# EasyEDA Pro project esp32-pcb.eprj

# Schematic Schematic1
Create Date: 2023-06-14; Page Name: P1; Project Name: esp32-pcb; Schematic Name: Schematic1; Update Date: 2023-06-14; Company: EasyEDA.com; Drawed: EasyEDA Pro; Page Size: A4; Part Number: JLCPCB-002; Reviewed: EasyEDA Pro; Version: V0.1
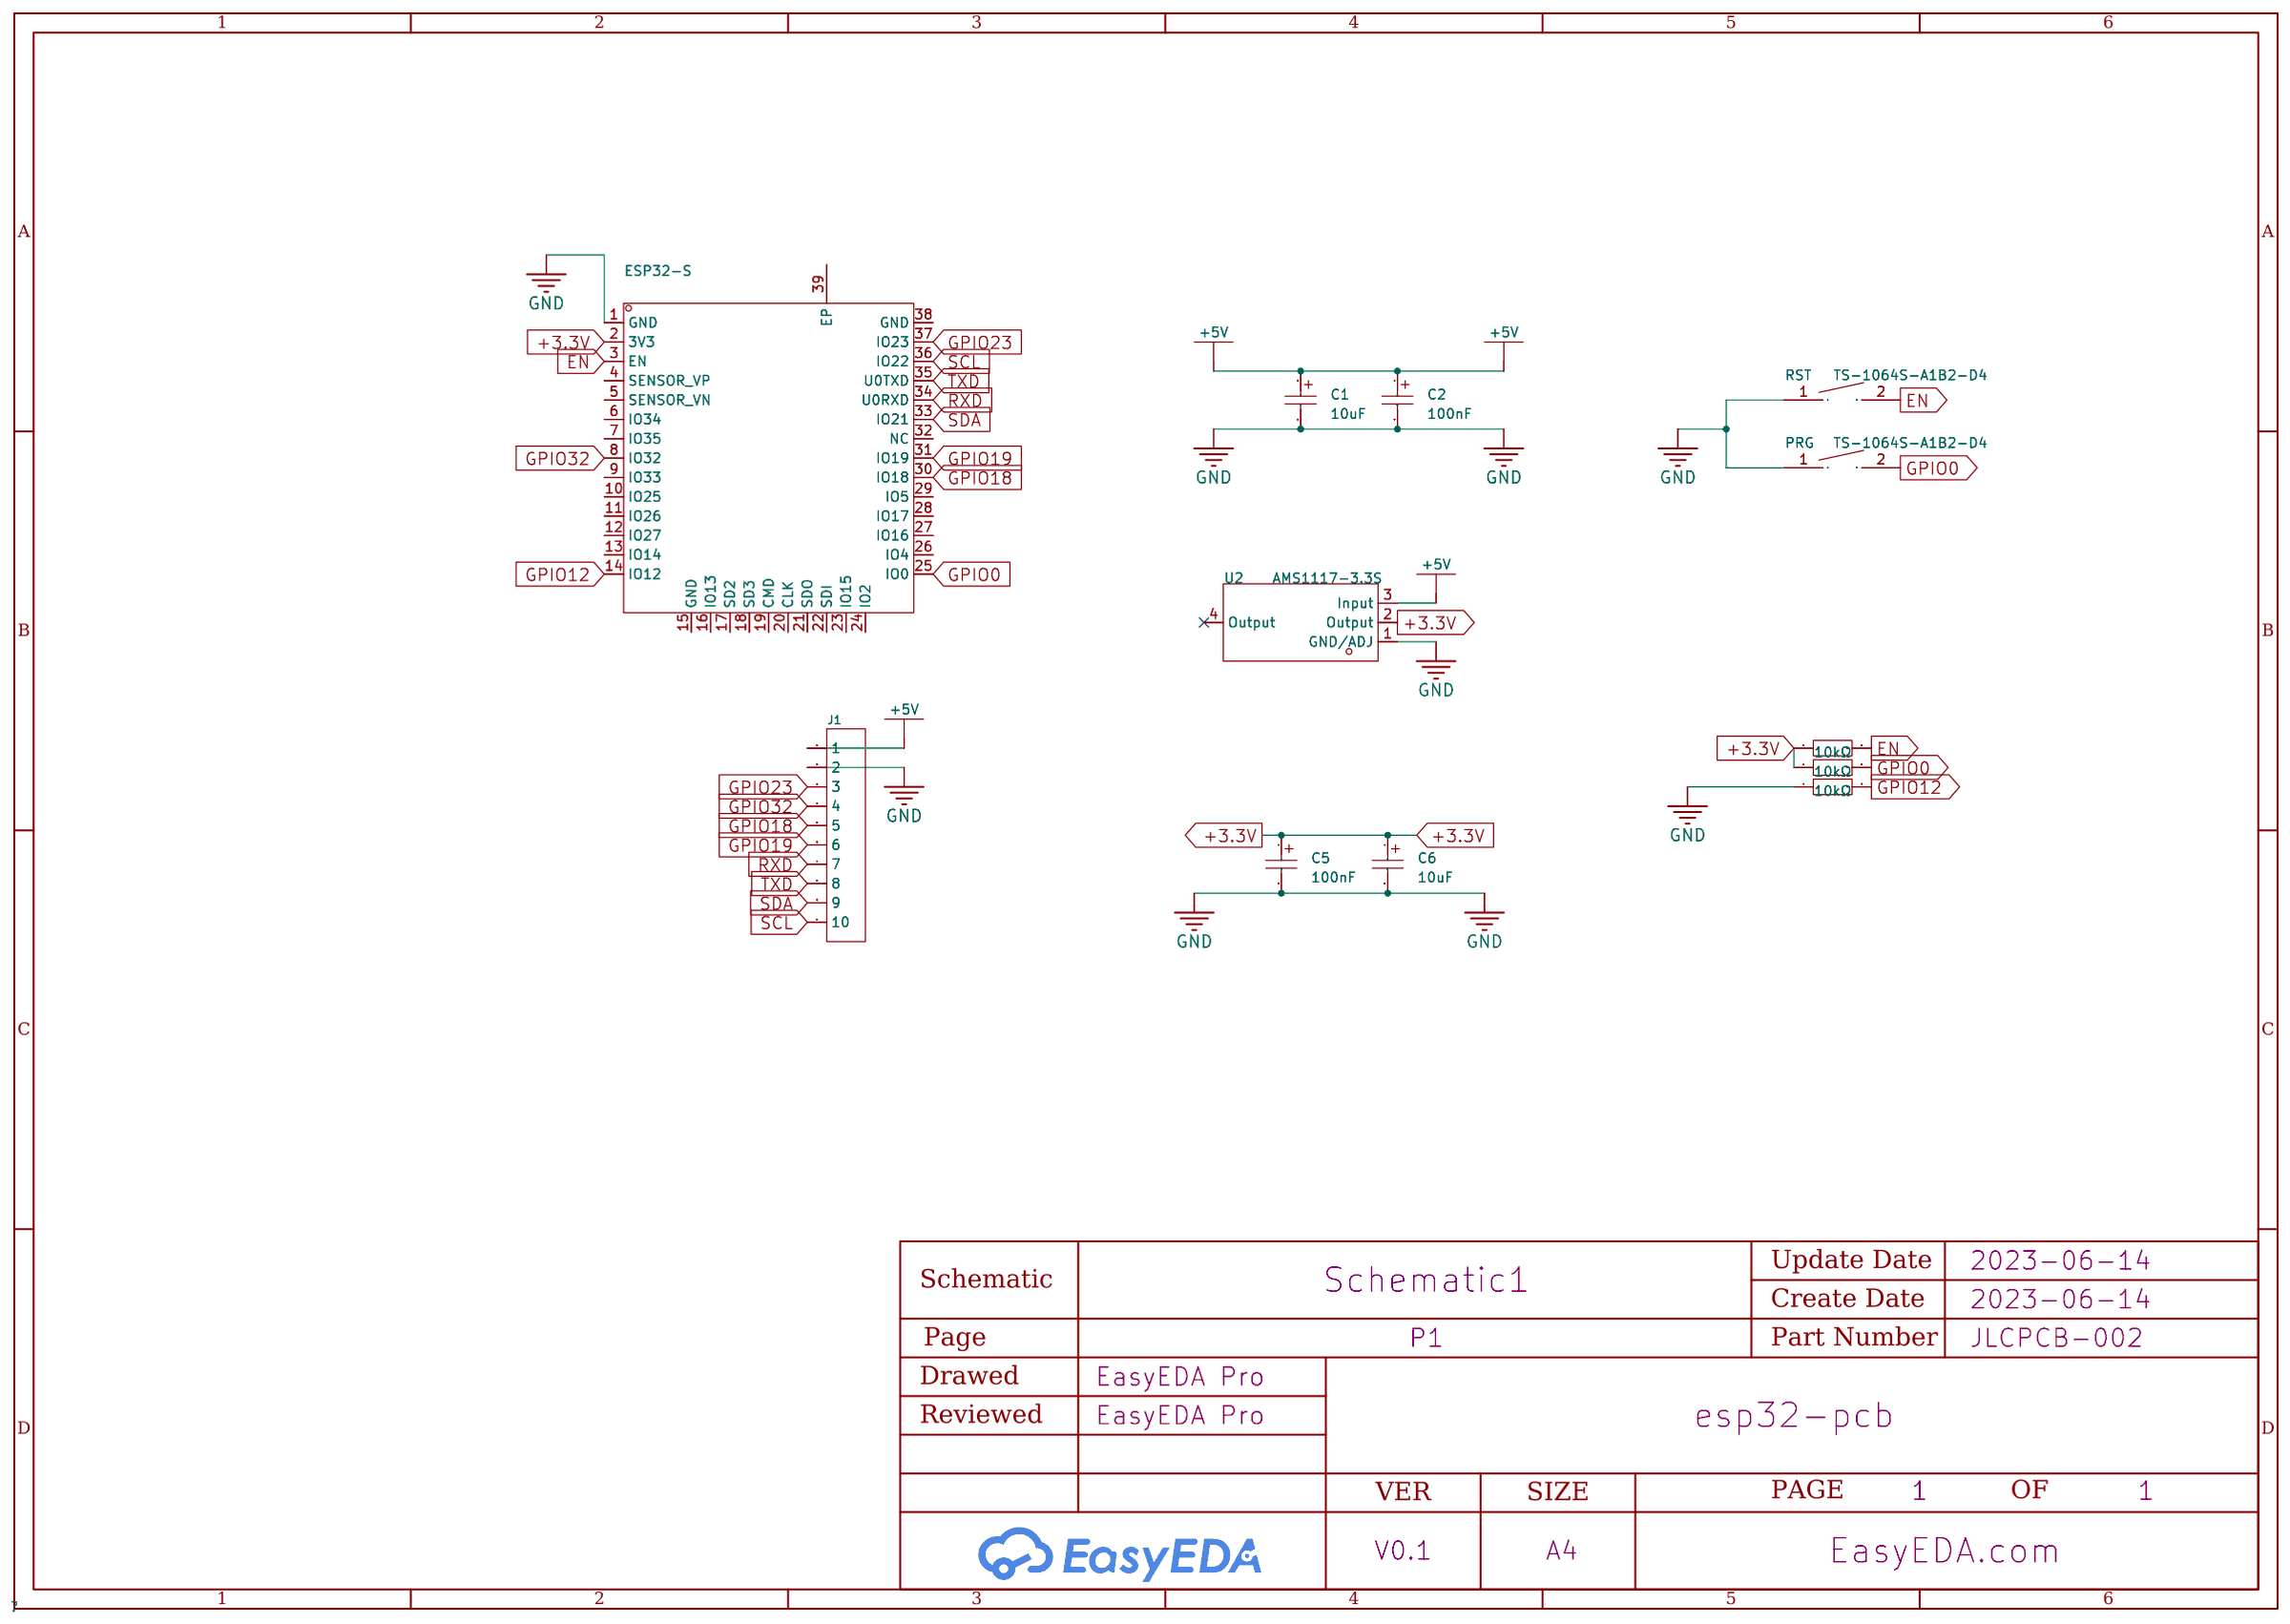
[diagram p0: schematic sheet]

## Parts
C1  10uF  [CASE-A_3216]
C2  100nF  [CASE-A_3216]
C5  100nF  [CASE-A_3216]
C6  10uF  [CASE-A_3216]
ESP32-S  2.4GHz  [WIRELM-SMD_ESP32-S]
J1  HDR-M-2.54_1x10  [HDR-TH_10P-P2.54-V-F-R2-C5-S2.54-4]
PRG  TS-1064S-A1B2-D4  [KEY-SMD_L3.0-W2.5-LS4.0]
R2  10kΩ  [R0603]
R3  10kΩ  [R0603]
R4  10kΩ  [R0603]
RST  TS-1064S-A1B2-D4  [KEY-SMD_L3.0-W2.5-LS4.0]
U2  AMS1117-3.3S  [SOT-223-4_L6.5-W3.5-P2.30-LS7.0-BL]

## Library data of the parts
C1 C6 = TAJA106K010RNJ: Capacitance: Tolerance:±10% Tolerance:±10% Rated Voltage: Equivalent Series Resistance(ESR):3Ω@100kHz Operating Temperature:-55~+125 Operating Temperature:-55~+125; LCSC Part Name: 10uF ±10% 10V; Supplier Part: C7177; Manufacturer: Kyocera AVX; JLCPCB Part Class: Extended Part; Datasheet: https://atta.szlcsc.com/upload/public/pdf/source/20160107/1457707748330.pdf; Supplier: LCSC; Tolerance: ±10%; Equivalent Series Resistance(ESR): 3Ω@100kHz; Operating Temperature: -55~+125
C2 C5 = TAJA104K035RNJ: Capacitance: Tolerance:±10% Tolerance:±10% Rated Voltage: Equivalent Series Resistance(ESR):24Ω@100kHz Operating Temperature:-55~+125 Operating Temperature:-55~+125; LCSC Part Name: 100nF ±10% 35V; Supplier Part: C7173; Manufacturer: Kyocera AVX; JLCPCB Part Class: Extended Part; Datasheet: https://atta.szlcsc.com/upload/public/pdf/source/20160107/1457707748183.pdf; Supplier: LCSC; Tolerance: ±10%; Equivalent Series Resistance(ESR): 24Ω@100kHz; Operating Temperature: -55~+125
ESP32-S = ESP32-S: Frequency:2.4GHz Output Power:17dBm Output Power:17dBm Core Processor:LX6 Support Interface:I2C；UART；DAC；SPI；PWM；ADC Antenna Type:板载 PCB Antenna/外接 IPEX Wireless Standard:802.11b/g/n Operating Voltage:3.3V Operating Voltage:3.3V Receive  Current:- Send  C; Supplier Part: C277944; Manufacturer: Ai-Thinker(安信可); Supplier Footprint: SMD; JLCPCB Part Class: Extended Part; Datasheet: https://atta.szlcsc.com/upload/public/pdf/source/20211217/F4BEA33E732D6002D10DAED85BBCB52B.pdf; Supplier: LCSC; Output Power: 17dBm; Core Processor: LX6; Support Interface: I2C；UART；DAC；SPI；PWM；ADC; Antenna Type: 板载 PCB Antenna/外接 IPEX; Wireless Standard: 802.11b/g/n; Operating Voltage: 3.3V; Sensitivity: -90dBm; Operating Temperature: -40℃~+85℃
J1 = HDR-M-2.54_1x10: Supplier Part: C57369; Supplier: LCSC
PRG RST = TS-1064S-A1B2-D4: Circuit:SPST Mounting Style:Brick nogging Actuator Style:Round Button With Lamp:- Operating Force:180gf@±30gf Switch Length:3mm Switch Width:2.5mm Switch Height:1.5mm; LCSC Part Name: 轻触开关3.0*2.5*1.5正按贴片小小龟180gf; Supplier Part: C498294; Manufacturer: Yuandi(台湾元迪); Supplier Footprint: SMD,3x2.5x1.5mm; JLCPCB Part Class: Extended Part; Datasheet: https://atta.szlcsc.com/upload/public/pdf/source/20200318/C498294_666F8F3E87612379939888B0D532704B.pdf; Supplier: LCSC; Circuit: SPST; Mounting Style: Brick nogging; Actuator Style: Round Button; Operating Force: 180gf@±30gf; Switch Length: 3mm; Switch Width: 2.5mm; Switch Height: 1.5mm
R2-R4 = RC0603JR-0710KL: Overload Voltage (Max): Resistance: Body Length:- Tolerance: φD:- Body Height:- Body Width:- Type:Thick Film Resistors Temperature Coefficient: Temperature Coefficient: Operating Temperature Range: Operating Temperature Range: Power(Watts):; LCSC Part Name: 10kΩ ±5%; Supplier Part: C99198; Manufacturer: YAGEO(国巨); Supplier Footprint: 0603; JLCPCB Part Class: Extended Part; Datasheet: https://atta.szlcsc.com/upload/public/pdf/source/20181223/C99198_917934A193F41F77D9F7D214A8C79116.pdf; Supplier: LCSC; Type: Thick Film Resistors
U2 = AMS1117-3.3S: Supplier Part: C2842296; Manufacturer: KEXIN(科信); Supplier Footprint: SOT-223; JLCPCB Part Class: Extended Part; Datasheet: https://atta.szlcsc.com/upload/public/pdf/source/20220119/687E7B65F4F54F278E2F75AE3BEEDBF9.pdf; Supplier: LCSC

## Nets
+3.3V: C5.1 C6.1 ESP32-S.2(3V3) R2.1 R4.1 U2.2(Output)
+5V: C1.1 C2.1 J1.1 U2.3(Input)
GND: C1.2 C2.2 C5.2 C6.2 ESP32-S.1(GND) J1.2 PRG.1 R3.1 RST.1 U2.1(GND/ADJ)
EN: ESP32-S.3(EN) R2.2 RST.2
GPIO0: ESP32-S.25(IO0) PRG.2 R4.2
GPIO12: ESP32-S.14(IO12) R3.2
GPIO18: ESP32-S.30(IO18) J1.5
GPIO19: ESP32-S.31(IO19) J1.6
GPIO23: ESP32-S.37(IO23) J1.3
GPIO32: ESP32-S.8(IO32) J1.4
RXD: ESP32-S.34(U0RXD) J1.7
SCL: ESP32-S.36(IO22) J1.10
SDA: ESP32-S.33(IO21) J1.9
TXD: ESP32-S.35(U0TXD) J1.8

Not connected (* = marked no-connect by the designer): ESP32-S 4(SENSOR_VP) 5(SENSOR_VN) 6(IO34) 7(IO35) 9(IO33) 10(IO25) 11(IO26) 12(IO27) 13(IO14) 15(GND) 16(IO13) 17(SD2) 18(SD3) 19(CMD) 20(CLK) 21(SDO) 22(SDI) 23(IO15) 24(IO2) 26(IO4) 27(IO16) 28(IO17) 29(IO5) 32(NC) 38(GND) 39(EP); U2 4(Output)*

# Schematic Schematic2
Create Date: 2023-08-26; Page Name: P2; Project Name: esp32-pcb; Schematic Name: Schematic2; Update Date: 2023-08-29; Company: EasyEDA.com; Drawed: EasyEDA Pro; Page Size: A4; Part Number: JLCPCB-002; Reviewed: EasyEDA Pro; Version: V0.1
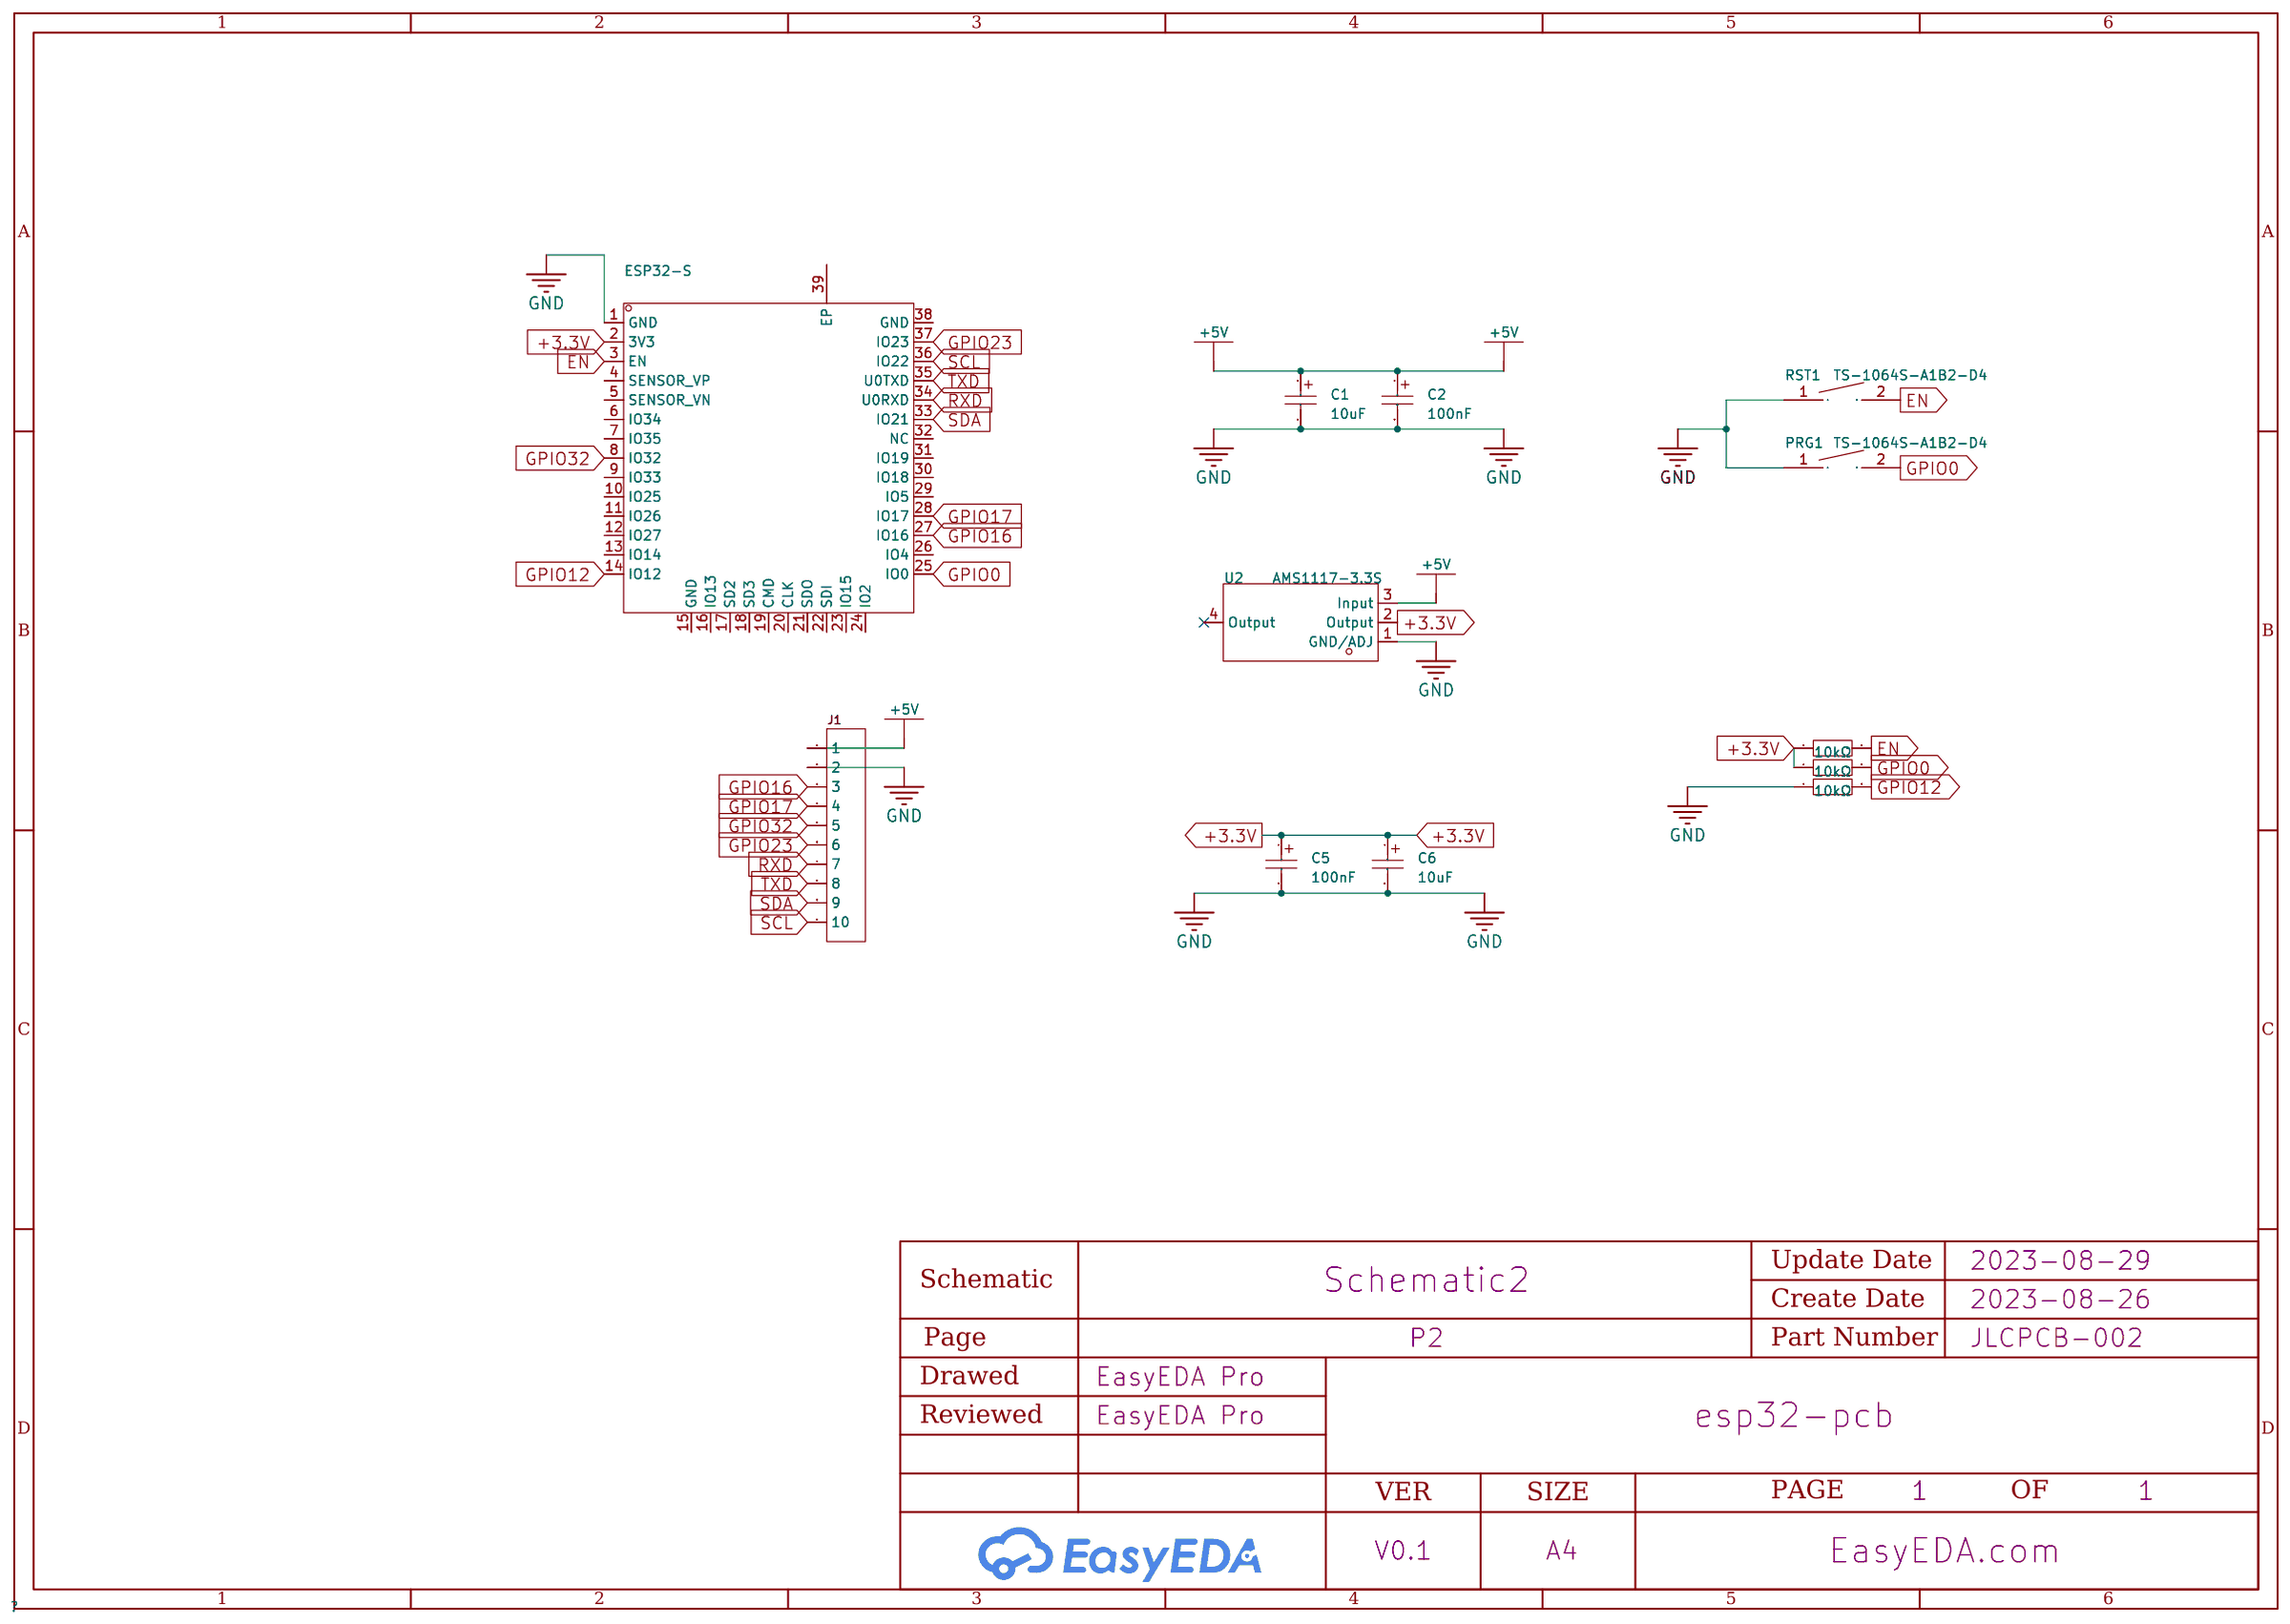
[diagram p1: schematic sheet]

## Parts
C1  10uF  [CASE-A_3216]
C2  100nF  [CASE-A_3216]
C5  100nF  [CASE-A_3216]
C6  10uF  [CASE-A_3216]
ESP32-S  2.4GHz  [WIRELM-SMD_ESP32-S]
J1  HDR-M-2.54_1x10  [HDR-TH_10P-P2.54-V-F-R2-C5-S2.54-4]
PRG1  TS-1064S-A1B2-D4  [KEY-SMD_L3.0-W2.5-LS4.0]
R2  10kΩ  [R0603]
R3  10kΩ  [R0603]
R4  10kΩ  [R0603]
RST1  TS-1064S-A1B2-D4  [KEY-SMD_L3.0-W2.5-LS4.0]
U2  AMS1117-3.3S  [SOT-223-4_L6.5-W3.5-P2.30-LS7.0-BL]

## Library data of the parts
C1 C6 = TAJA106K010RNJ: Capacitance: Tolerance:±10% Tolerance:±10% Rated Voltage: Equivalent Series Resistance(ESR):3Ω@100kHz Operating Temperature:-55~+125 Operating Temperature:-55~+125; LCSC Part Name: 10uF ±10% 10V; Supplier Part: C7177; Manufacturer: Kyocera AVX; JLCPCB Part Class: Extended Part; Datasheet: https://atta.szlcsc.com/upload/public/pdf/source/20160107/1457707748330.pdf; Supplier: LCSC; Tolerance: ±10%; Equivalent Series Resistance(ESR): 3Ω@100kHz; Operating Temperature: -55~+125
C2 C5 = TAJA104K035RNJ: Capacitance: Tolerance:±10% Tolerance:±10% Rated Voltage: Equivalent Series Resistance(ESR):24Ω@100kHz Operating Temperature:-55~+125 Operating Temperature:-55~+125; LCSC Part Name: 100nF ±10% 35V; Supplier Part: C7173; Manufacturer: Kyocera AVX; JLCPCB Part Class: Extended Part; Datasheet: https://atta.szlcsc.com/upload/public/pdf/source/20160107/1457707748183.pdf; Supplier: LCSC; Tolerance: ±10%; Equivalent Series Resistance(ESR): 24Ω@100kHz; Operating Temperature: -55~+125
ESP32-S = ESP32-S: Frequency:2.4GHz Output Power:17dBm Output Power:17dBm Core Processor:LX6 Support Interface:I2C；UART；DAC；SPI；PWM；ADC Antenna Type:板载 PCB Antenna/外接 IPEX Wireless Standard:802.11b/g/n Operating Voltage:3.3V Operating Voltage:3.3V Receive  Current:- Send  C; Supplier Part: C277944; Manufacturer: Ai-Thinker(安信可); Supplier Footprint: SMD; JLCPCB Part Class: Extended Part; Datasheet: https://atta.szlcsc.com/upload/public/pdf/source/20211217/F4BEA33E732D6002D10DAED85BBCB52B.pdf; Supplier: LCSC; Output Power: 17dBm; Core Processor: LX6; Support Interface: I2C；UART；DAC；SPI；PWM；ADC; Antenna Type: 板载 PCB Antenna/外接 IPEX; Wireless Standard: 802.11b/g/n; Operating Voltage: 3.3V; Sensitivity: -90dBm; Operating Temperature: -40℃~+85℃
J1 = HDR-M-2.54_1x10: Supplier Part: C57369; Supplier: LCSC
PRG1 RST1 = TS-1064S-A1B2-D4: Circuit:SPST Mounting Style:Brick nogging Actuator Style:Round Button With Lamp:- Operating Force:180gf@±30gf Switch Length:3mm Switch Width:2.5mm Switch Height:1.5mm; LCSC Part Name: 轻触开关3.0*2.5*1.5正按贴片小小龟180gf; Supplier Part: C498294; Manufacturer: Yuandi(台湾元迪); Supplier Footprint: SMD,3x2.5x1.5mm; JLCPCB Part Class: Extended Part; Datasheet: https://atta.szlcsc.com/upload/public/pdf/source/20200318/C498294_666F8F3E87612379939888B0D532704B.pdf; Supplier: LCSC; Circuit: SPST; Mounting Style: Brick nogging; Actuator Style: Round Button; Operating Force: 180gf@±30gf; Switch Length: 3mm; Switch Width: 2.5mm; Switch Height: 1.5mm
R2-R4 = RC0603JR-0710KL: Overload Voltage (Max): Resistance: Body Length:- Tolerance: φD:- Body Height:- Body Width:- Type:Thick Film Resistors Temperature Coefficient: Temperature Coefficient: Operating Temperature Range: Operating Temperature Range: Power(Watts):; LCSC Part Name: 10kΩ ±5%; Supplier Part: C99198; Manufacturer: YAGEO(国巨); Supplier Footprint: 0603; JLCPCB Part Class: Extended Part; Datasheet: https://atta.szlcsc.com/upload/public/pdf/source/20181223/C99198_917934A193F41F77D9F7D214A8C79116.pdf; Supplier: LCSC; Type: Thick Film Resistors
U2 = AMS1117-3.3S: Supplier Part: C2842296; Manufacturer: KEXIN(科信); Supplier Footprint: SOT-223; JLCPCB Part Class: Extended Part; Datasheet: https://atta.szlcsc.com/upload/public/pdf/source/20220119/687E7B65F4F54F278E2F75AE3BEEDBF9.pdf; Supplier: LCSC

## Nets
+3.3V: C5.1 C6.1 ESP32-S.2(3V3) R2.1 R4.1 U2.2(Output)
+5V: C1.1 C2.1 J1.1 U2.3(Input)
GND: C1.2 C2.2 C5.2 C6.2 ESP32-S.1(GND) J1.2 PRG1.1 R3.1 RST1.1 U2.1(GND/ADJ)
EN: ESP32-S.3(EN) R2.2 RST1.2
GPIO0: ESP32-S.25(IO0) PRG1.2 R4.2
GPIO12: ESP32-S.14(IO12) R3.2
GPIO16: ESP32-S.27(IO16) J1.3
GPIO17: ESP32-S.28(IO17) J1.4
GPIO23: ESP32-S.37(IO23) J1.6
GPIO32: ESP32-S.8(IO32) J1.5
RXD: ESP32-S.34(U0RXD) J1.7
SCL: ESP32-S.36(IO22) J1.10
SDA: ESP32-S.33(IO21) J1.9
TXD: ESP32-S.35(U0TXD) J1.8

Not connected (* = marked no-connect by the designer): ESP32-S 4(SENSOR_VP) 5(SENSOR_VN) 6(IO34) 7(IO35) 9(IO33) 10(IO25) 11(IO26) 12(IO27) 13(IO14) 15(GND) 16(IO13) 17(SD2) 18(SD3) 19(CMD) 20(CLK) 21(SDO) 22(SDI) 23(IO15) 24(IO2) 26(IO4) 29(IO5) 30(IO18) 31(IO19) 32(NC) 38(GND) 39(EP); U2 4(Output)*

# Schematic Schematic3
Create Date: 2023-09-21; Page Name: P2; Project Name: esp32-pcb; Schematic Name: Schematic3; Update Date: 2023-10-17; Company: EasyEDA.com; Drawed: EasyEDA Pro; Page Size: A4; Part Number: JLCPCB-002; Reviewed: EasyEDA Pro; Version: V0.1
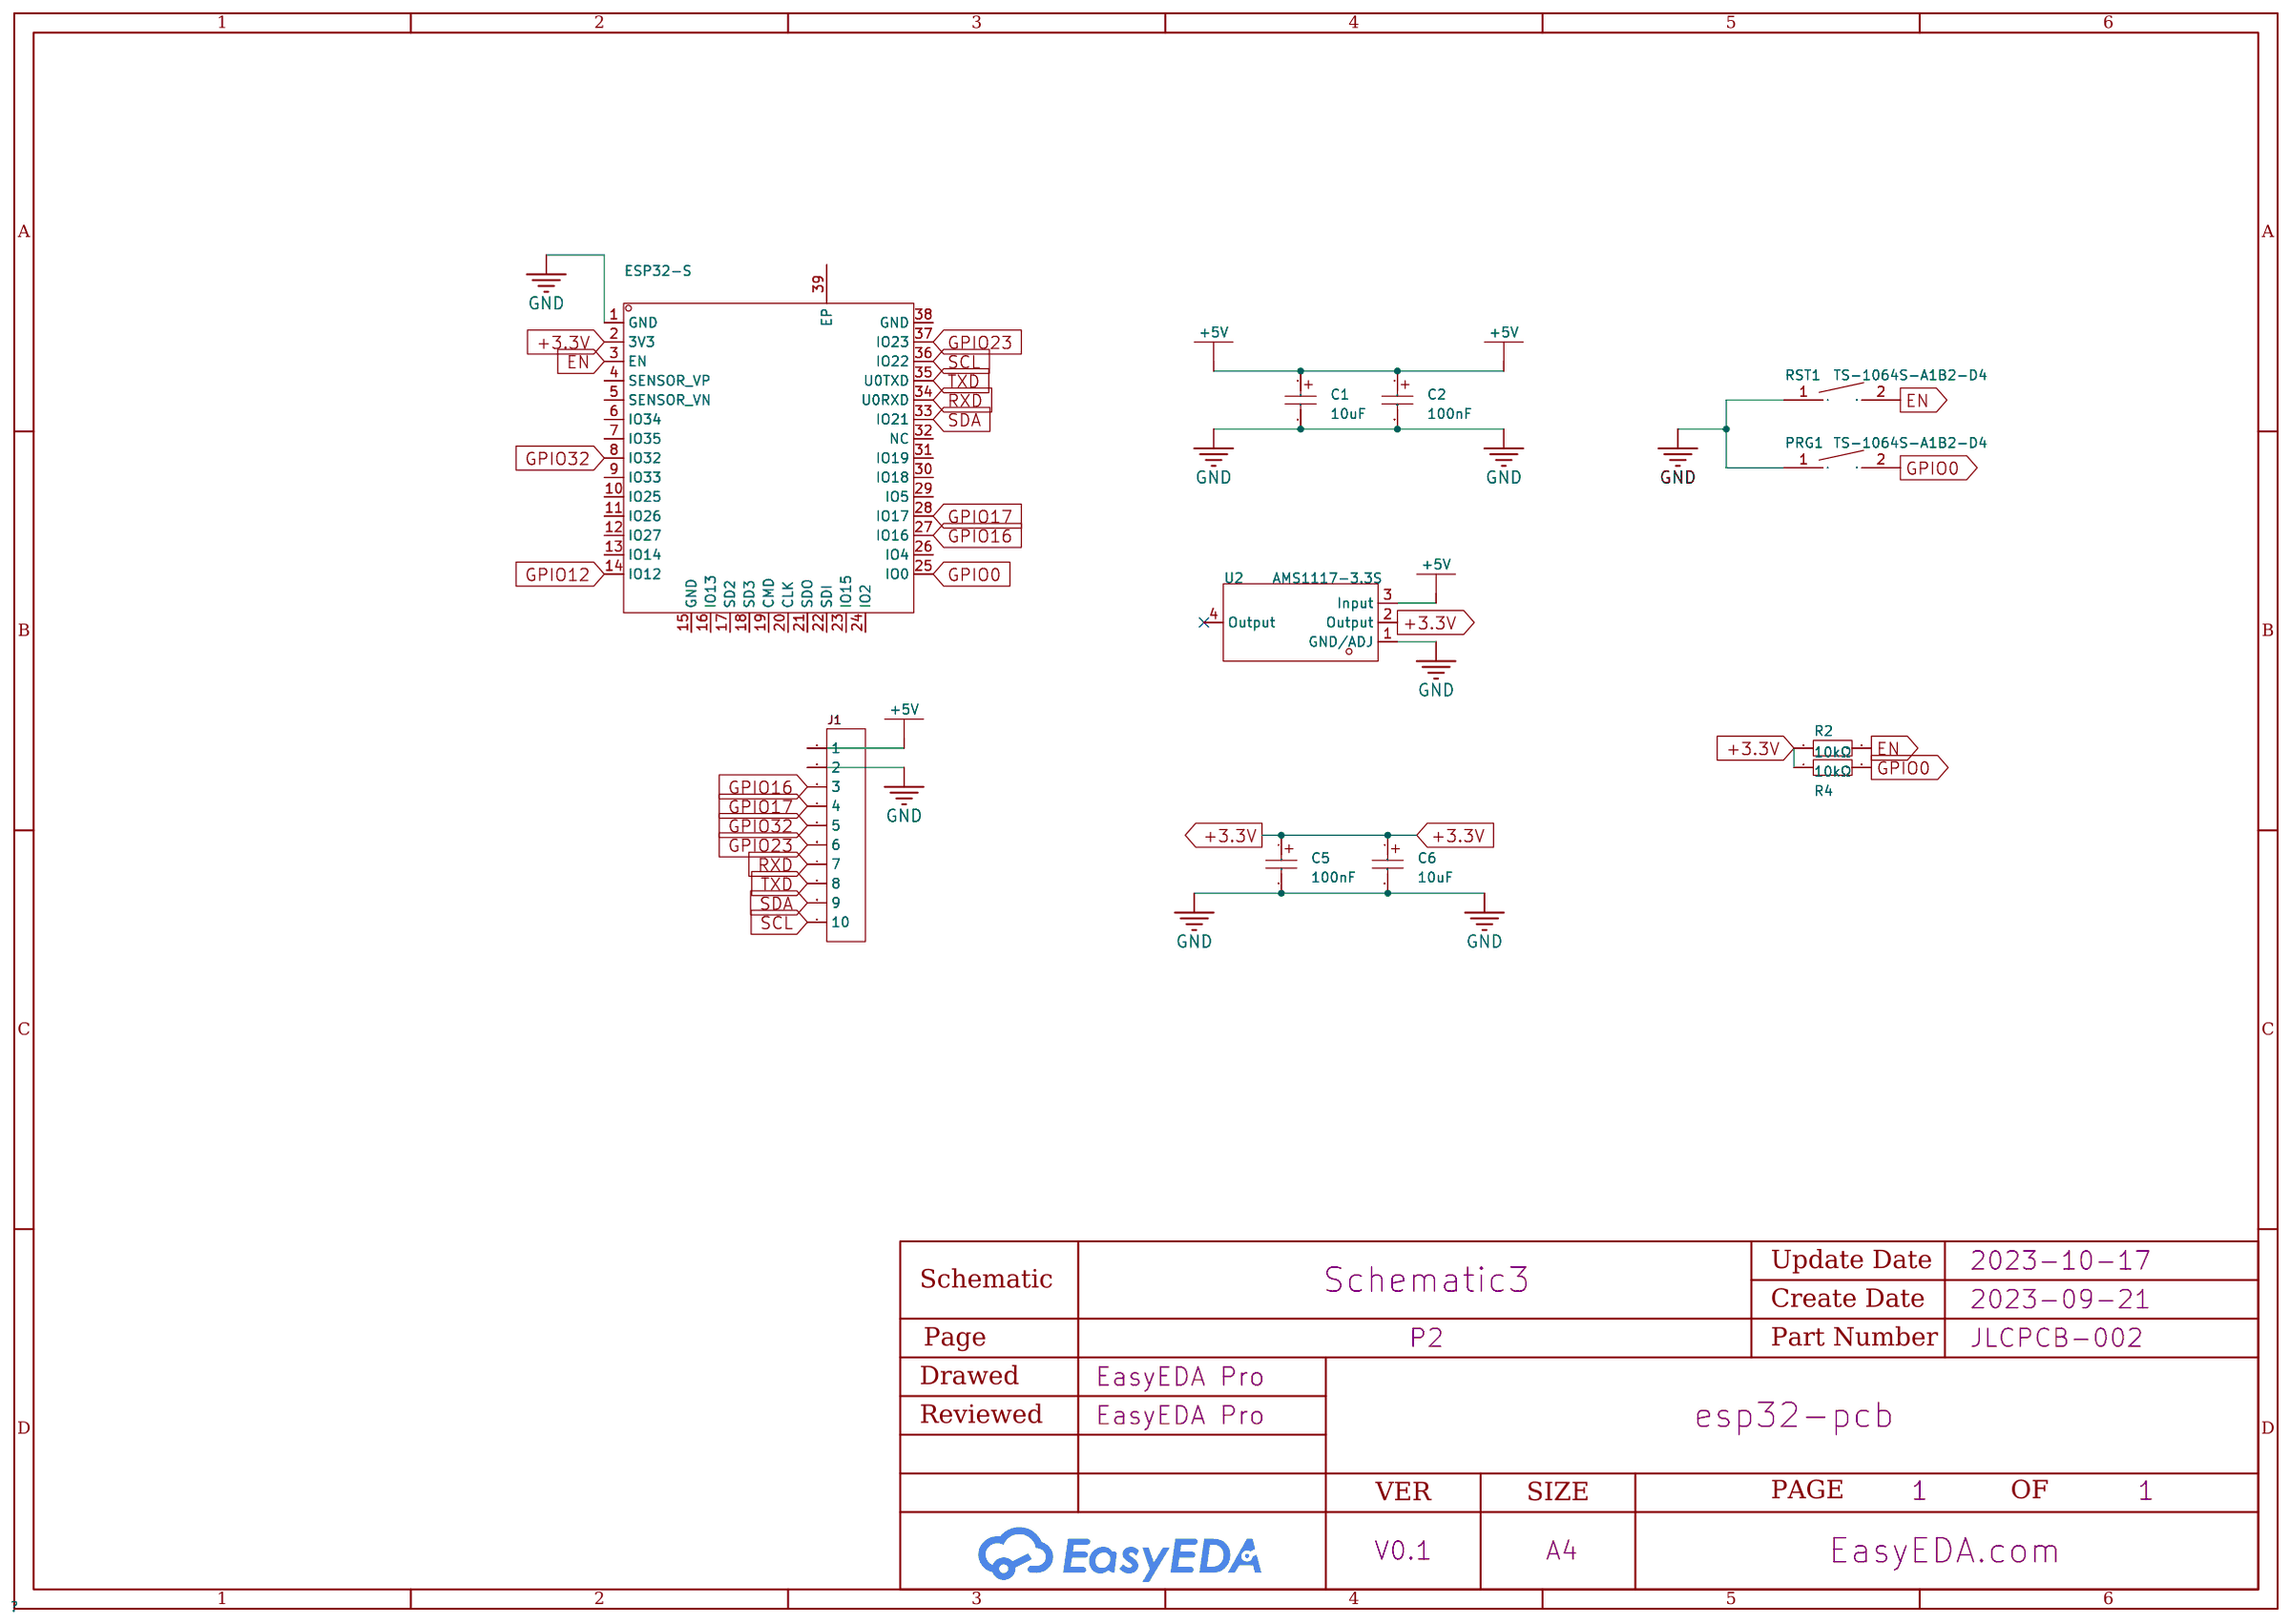
[diagram p2: schematic sheet]

## Parts
C1  10uF  [CASE-A_3216]
C2  100nF  [CASE-A_3216]
C5  100nF  [CASE-A_3216]
C6  10uF  [CASE-A_3216]
ESP32-S  2.4GHz  [WIRELM-SMD_ESP32-S]
J1  HDR-M-2.54_1x10  [HDR-TH_10P-P2.54-V-F-R2-C5-S2.54-4]
PRG1  TS-1064S-A1B2-D4  [KEY-SMD_L3.0-W2.5-LS4.0]
R2  10kΩ  [R0603]
R4  10kΩ  [R0603]
RST1  TS-1064S-A1B2-D4  [KEY-SMD_L3.0-W2.5-LS4.0]
U2  AMS1117-3.3S  [SOT-223-4_L6.5-W3.5-P2.30-LS7.0-BL]

## Library data of the parts
C1 C6 = TAJA106K010RNJ: Capacitance: Tolerance:±10% Tolerance:±10% Rated Voltage: Equivalent Series Resistance(ESR):3Ω@100kHz Operating Temperature:-55~+125 Operating Temperature:-55~+125; LCSC Part Name: 10uF ±10% 10V; Supplier Part: C7177; Manufacturer: Kyocera AVX; JLCPCB Part Class: Extended Part; Datasheet: https://atta.szlcsc.com/upload/public/pdf/source/20160107/1457707748330.pdf; Supplier: LCSC; Tolerance: ±10%; Equivalent Series Resistance(ESR): 3Ω@100kHz; Operating Temperature: -55~+125
C2 C5 = TAJA104K035RNJ: Capacitance: Tolerance:±10% Tolerance:±10% Rated Voltage: Equivalent Series Resistance(ESR):24Ω@100kHz Operating Temperature:-55~+125 Operating Temperature:-55~+125; LCSC Part Name: 100nF ±10% 35V; Supplier Part: C7173; Manufacturer: Kyocera AVX; JLCPCB Part Class: Extended Part; Datasheet: https://atta.szlcsc.com/upload/public/pdf/source/20160107/1457707748183.pdf; Supplier: LCSC; Tolerance: ±10%; Equivalent Series Resistance(ESR): 24Ω@100kHz; Operating Temperature: -55~+125
ESP32-S = ESP32-S: Frequency:2.4GHz Output Power:17dBm Output Power:17dBm Core Processor:LX6 Support Interface:I2C；UART；DAC；SPI；PWM；ADC Antenna Type:板载 PCB Antenna/外接 IPEX Wireless Standard:802.11b/g/n Operating Voltage:3.3V Operating Voltage:3.3V Receive  Current:- Send  C; Supplier Part: C277944; Manufacturer: Ai-Thinker(安信可); Supplier Footprint: SMD; JLCPCB Part Class: Extended Part; Datasheet: https://atta.szlcsc.com/upload/public/pdf/source/20211217/F4BEA33E732D6002D10DAED85BBCB52B.pdf; Supplier: LCSC; Output Power: 17dBm; Core Processor: LX6; Support Interface: I2C；UART；DAC；SPI；PWM；ADC; Antenna Type: 板载 PCB Antenna/外接 IPEX; Wireless Standard: 802.11b/g/n; Operating Voltage: 3.3V; Sensitivity: -90dBm; Operating Temperature: -40℃~+85℃
J1 = HDR-M-2.54_1x10: Supplier Part: C57369; Supplier: LCSC
PRG1 RST1 = TS-1064S-A1B2-D4: Circuit:SPST Mounting Style:Brick nogging Actuator Style:Round Button With Lamp:- Operating Force:180gf@±30gf Switch Length:3mm Switch Width:2.5mm Switch Height:1.5mm; LCSC Part Name: 轻触开关3.0*2.5*1.5正按贴片小小龟180gf; Supplier Part: C498294; Manufacturer: Yuandi(台湾元迪); Supplier Footprint: SMD,3x2.5x1.5mm; JLCPCB Part Class: Extended Part; Datasheet: https://atta.szlcsc.com/upload/public/pdf/source/20200318/C498294_666F8F3E87612379939888B0D532704B.pdf; Supplier: LCSC; Circuit: SPST; Mounting Style: Brick nogging; Actuator Style: Round Button; Operating Force: 180gf@±30gf; Switch Length: 3mm; Switch Width: 2.5mm; Switch Height: 1.5mm
R2 R4 = RC0603JR-0710KL: Overload Voltage (Max): Resistance: Body Length:- Tolerance: φD:- Body Height:- Body Width:- Type:Thick Film Resistors Temperature Coefficient: Temperature Coefficient: Operating Temperature Range: Operating Temperature Range: Power(Watts):; LCSC Part Name: 10kΩ ±5%; Supplier Part: C99198; Manufacturer: YAGEO(国巨); Supplier Footprint: 0603; JLCPCB Part Class: Extended Part; Datasheet: https://atta.szlcsc.com/upload/public/pdf/source/20181223/C99198_917934A193F41F77D9F7D214A8C79116.pdf; Supplier: LCSC; Type: Thick Film Resistors
U2 = AMS1117-3.3S: Supplier Part: C2842296; Manufacturer: KEXIN(科信); Supplier Footprint: SOT-223; JLCPCB Part Class: Extended Part; Datasheet: https://atta.szlcsc.com/upload/public/pdf/source/20220119/687E7B65F4F54F278E2F75AE3BEEDBF9.pdf; Supplier: LCSC

## Nets
+3.3V: C5.1 C6.1 ESP32-S.2(3V3) R2.1 R4.1 U2.2(Output)
+5V: C1.1 C2.1 J1.1 U2.3(Input)
GND: C1.2 C2.2 C5.2 C6.2 ESP32-S.1(GND) J1.2 PRG1.1 RST1.1 U2.1(GND/ADJ)
EN: ESP32-S.3(EN) R2.2 RST1.2
GPIO0: ESP32-S.25(IO0) PRG1.2 R4.2
GPIO12: ESP32-S.14(IO12)
GPIO16: ESP32-S.27(IO16) J1.3
GPIO17: ESP32-S.28(IO17) J1.4
GPIO23: ESP32-S.37(IO23) J1.6
GPIO32: ESP32-S.8(IO32) J1.5
RXD: ESP32-S.34(U0RXD) J1.7
SCL: ESP32-S.36(IO22) J1.10
SDA: ESP32-S.33(IO21) J1.9
TXD: ESP32-S.35(U0TXD) J1.8

Not connected (* = marked no-connect by the designer): ESP32-S 4(SENSOR_VP) 5(SENSOR_VN) 6(IO34) 7(IO35) 9(IO33) 10(IO25) 11(IO26) 12(IO27) 13(IO14) 15(GND) 16(IO13) 17(SD2) 18(SD3) 19(CMD) 20(CLK) 21(SDO) 22(SDI) 23(IO15) 24(IO2) 26(IO4) 29(IO5) 30(IO18) 31(IO19) 32(NC) 38(GND) 39(EP); U2 4(Output)*

# Board PCB1
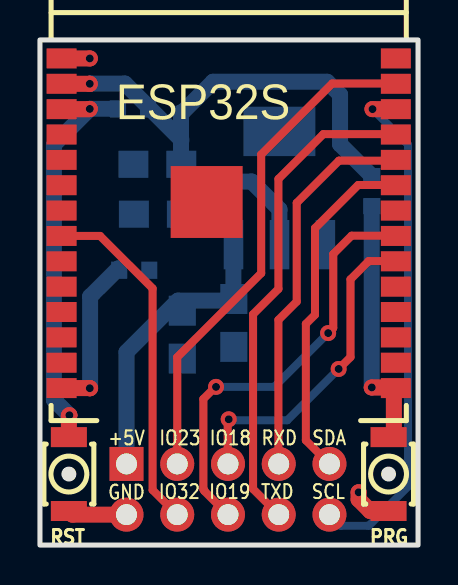
[diagram p3: board, top side]
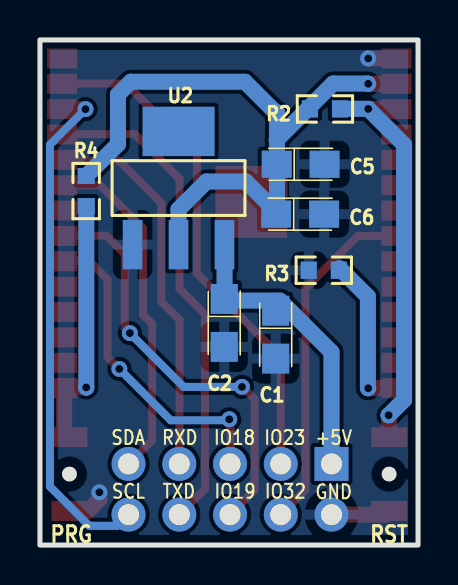
[diagram p4: board, bottom side, seen from below]

Outline 18.93 x 25.3 mm; copper layers: Top Layer, Bottom Layer. Coordinates in mm from the lower left corner of the outline.
Outline path: rectangle 0,25.3 18.93,0
Stack: Top Layer 0.035mm / Dielectric1 1.51mm FR4 er 4.5 / Bottom Layer 0.035mm

## Design rules (mm)
spacing safeClearance (default): track to track 0.152, other pairs 0.152 to 0.3
track width trackWidth (default): min 0.127, default 0.254, max 2.54
differential pair differentialPair (default): width min 0.127, default 0.254, max 2.54; gap min 0.152, default 0.152
via viaSize (default): diameter min 0.5, default 0.61, max 10; hole min 0.3, default 0.305, max 6

## Placement (name value [footprint] x y rotation side)
C1  10uF  [CASE-A_3216]  7.13 10.54 270 bottom
C2  100nF  [CASE-A_3216]  9.7 11.12 270 bottom
C5  100nF  [CASE-A_3216]  5.88 19.07 180 bottom
C6  10uF  [CASE-A_3216]  5.9 16.57 180 bottom
ESP32S  2.4GHz  [WIRELM-SMD_ESP32-S]  9.45 15.37 0 top
J1  HDR-M-2.54_1x10  [HDR-TH_10P-P2.54-V-F-R2-C5-S2.54-4]  9.41 2.79 0 top
PRG  TS-1064S-A1B2-D4  [KEY-SMD_L3.0-W2.5-LS4.0]  17.45 3.56 90 top
R2  10kΩ  [R0603]  4.66 21.84 180 bottom
R3  10kΩ  [R0603]  4.72 13.76 180 bottom
R4  10kΩ  [R0603]  16.61 17.73 270 bottom
RST  TS-1064S-A1B2-D4  [KEY-SMD_L3.0-W2.5-LS4.0]  1.45 3.56 90 top
U2  AMS1117-3.3S  [SOT-223-4_L6.5-W3.5-P2.30-LS7.0-BL]  11.99 17.88 180 bottom

## Footprints (pads in the part's own frame, mm; a bottom-side part is the same pattern mirrored in y, then rotated)
CASE-A_3216
  rect 1.5x1.359 smd: 1(-1.2,0) 2(1.2,0)
HDR-TH_10P-P2.54-V-F-R2-C5-S2.54-4
  rect 1.7x1.7 hole 1.05: 1(-5.08,1.27)
  round 1.7 hole 1.05: 2(-5.08,-1.27) 3(-2.54,1.27) 4(-2.54,-1.27) 5(0,1.27) 6(0,-1.27) 7(2.54,1.27) 8(2.54,-1.27) 9(5.08,1.27) 10(5.08,-1.27)
KEY-SMD_L3.0-W2.5-LS4.0
  rect 1x1.8 smd: 1(-1.85,0) 2(1.85,0)
R0603
  rect 0.806x0.864 smd: 1(-0.753,0) 2(0.753,0)
SOT-223-4_L6.5-W3.5-P2.30-LS7.0-BL
  rect 0.98x2.47 smd: 1(-2.3,-2.835) 2(0,-2.835) 3(2.3,-2.835)
  rect 3.6x2.47 smd: 4(0,2.835)
WIRELM-SMD_ESP32-S
  rect 1.498x1 smd: 1(-8.365,9.005) 2(-8.365,7.735) 3(-8.365,6.465) 4(-8.365,5.195) 5(-8.365,3.925) 6(-8.365,2.655) 7(-8.365,1.385) 8(-8.365,0.115) 9(-8.365,-1.155) 10(-8.365,-2.425) 11(-8.365,-3.695) 12(-8.365,-4.965) 13(-8.365,-6.235) 14(-8.365,-7.505) 25(8.365,-7.505) 26(8.365,-6.235) 27(8.365,-4.965) 28(8.365,-3.695) 29(8.365,-2.425) 30(8.365,-1.155) 31(8.365,0.115) 32(8.365,1.385) 33(8.365,2.655) 34(8.365,3.925) 35(8.365,5.195) 36(8.365,6.465) 37(8.365,7.735) 38(8.365,9.005)
  rect 3.6x3.6 smd: 39(-1.105,1.815)

## Nets
+3.3V: C5.1 C6.1 ESP32S.2 R2.1 R4.1 U2.2
+5V: C1.1 C2.1 J1.1 U2.3
GND: C1.2 C2.2 C5.2 C6.2 ESP32S.1 J1.2 PRG.1 R3.1 RST.1 U2.1
EN: ESP32S.3 R2.2 RST.2
GPIO0: ESP32S.25 PRG.2 R4.2
GPIO12: ESP32S.14 R3.2
GPIO18: ESP32S.30 J1.5
GPIO19: ESP32S.31 J1.6
GPIO23: ESP32S.37 J1.3
GPIO32: ESP32S.8 J1.4
RXD: ESP32S.34 J1.7
SCL: ESP32S.36 J1.10
SDA: ESP32S.33 J1.9
TXD: ESP32S.35 J1.8

Pads without a net: ESP32S 4 5 6 7 9 10 11 12 13 26 27 28 29 32 38 39; U2 4

## Via types
v1: diameter 0.8, hole 0.4, Top Layer to Bottom Layer, 12 vias

## Routing (per net, layer and track width the routed paths; a pad name or vN(x,y) marks a point on that pad's centre or on a via; arc(x,y) is an arc through that point)
+3.3V: length 33.9
  Top Layer w0.8: 2.49,23.09 2.48,23.1 ESP32S.2
  Bottom Layer w0.8: 7.06,20.31 4.25,23.11 2.53,23.11 2.52,23.1 ; 7.06,20.31 7.06,21.67 7.13,21.67 8.66,23.2 14.38,23.2 15.02,22.56 15.02,20.07 R4.1 ; 7.06,20.31 7.08,20.29 ; 7.06,20.31 7.06,16.74 7.11,16.7 ; 7.11,16.7 7.11,16.51 ; 7.11,16.7 8.62,18.21 10.6,18.21 11.99,16.81 U2.2 ; 7.11,16.7 7.04,16.63
  vias: v1(2.49,23.1)
+5V: length 14.5
  Bottom Layer w0.8: U2.3 9.69,15.04 9.69,12.72 9.21,12.24 6.91,12.24 4.33,9.67 J1.1
GND: length 6.5
  Top Layer w0.8: J1.2 1.63,1.52 RST.1 ; v1(15.95,2.64) 15.95,2.29 16.53,1.71 PRG.1 ; ESP32S.1 v1(2.49,24.37)
EN: length 20.3
  Top Layer w0.8: ESP32S.3 2.48,21.83 2.49,21.84 ; RST.2 1.45,6.48 v1(1.47,6.5)
  Bottom Layer w0.8: v1(1.47,6.5) 1.47,6.5 0.7,7.27 0.7,20.05 2.49,21.85 3.82,21.85
  vias: v1(2.49,21.84)
GPIO0: length 12.8
  Top Layer w0.8: ESP32S.25 17.78,7.89 17.61,7.89 ; v1(16.61,7.89) 17.61,7.89 ; 17.61,7.89 17.72,7.78 17.72,5.67 PRG.2
  Bottom Layer w0.8: v1(16.61,7.89) 16.61,7.9 16.61,16.85
GPIO12: length 8
  Top Layer w0.8: 2.51,7.86 2.48,7.86 2.48,7.86 ESP32S.14
  Bottom Layer w0.8: 3.93,13.87 2.51,12.45 2.51,7.86
  vias: v1(2.49,7.86)
GPIO18: length 16.2
  Top Layer w0.4: v1(14.95,8.82) 15.55,9.41 15.55,13.31 16.46,14.22 17.8,14.22 ESP32S.30 ; v1(9.45,6.3) 9.4,6.25 9.4,4.08 J1.5
  Bottom Layer w0.4: v1(9.45,6.3) 9.5,6.25 12.38,6.25 v1(14.95,8.82)
GPIO19: length 21.5
  Top Layer w0.4: ESP32S.31 17.8,15.49 15.6,15.49 14.68,14.58 14.68,10.87 v1(14.43,10.62) ; v1(8.81,7.92) 8.79,7.92 8.18,7.31 8.18,2.79 8.23,2.74 8.23,2.71 J1.6
  Bottom Layer w0.4: v1(14.43,10.62) 11.73,7.92 v1(8.81,7.92)
GPIO23: length 25.5
  Top Layer w0.4: ESP32S.37 17.8,23.11 14.63,23.11 11.07,19.56 11.07,13.61 6.87,9.41 J1.3
GPIO32: length 17.5
  Top Layer w0.4: J1.4 5.64,2.76 5.64,12.85 3.01,15.48 ESP32S.8
RXD: length 19.3
  Top Layer w0.4: J1.7 11.94,4.08 11.94,11.28 12.85,12.19 12.85,17.14 14.97,19.25 17.78,19.25 ESP32S.34
SCL: length 25.8
  Top Layer w0.8: v1(16.65,21.83) ESP32S.36
  Bottom Layer w0.4: J1.10 15.05,0.96 16.46,0.96 18.43,2.93 18.43,20.05 v1(16.65,21.83)
SDA: length 17.4
  Top Layer w0.4: J1.9 13.31,5.25 13.31,11.07 13.77,11.53 13.77,15.87 15.93,18.03 17.8,18.03 ESP32S.33
TXD: length 24.7
  Top Layer w0.4: ESP32S.35 17.79,20.58 14.18,20.58 11.94,18.34 11.94,12.83 10.67,11.56 10.67,2.81 J1.8

## Copper pours and planes (outline as drawn; the poured copper is in the pictures)
GND on Bottom Layer: 0.1,25.15 18.83,25.15 18.83,0 0.1,0

## Text on the board
Bottom Silkscreen Layer: +5V | GND | IO32 | IO23 | IO19 | IO18 | TXD | RXD | SCL | SDA | RST | PRG
Top Silkscreen Layer: +5V | GND | IO32 | IO23 | IO19 | IO18 | TXD | RXD | SCL | SDA

# Board PCB2
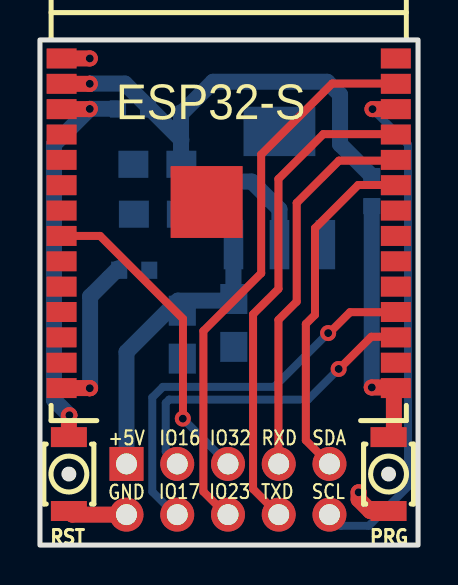
[diagram p5: board, top side]
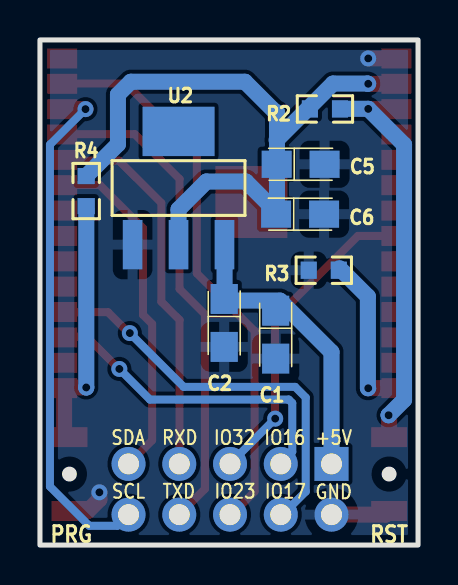
[diagram p6: board, bottom side, seen from below]

Outline 18.93 x 25.3 mm; copper layers: Top Layer, Bottom Layer. Coordinates in mm from the lower left corner of the outline.
Outline path: rectangle 0,25.3 18.93,0
Stack: Top Layer 0.035mm / Dielectric1 1.51mm FR4 er 4.5 / Bottom Layer 0.035mm

## Design rules (mm)
spacing safeClearance (default): track to track 0.152, other pairs 0.152 to 0.3
track width trackWidth (default): min 0.127, default 0.254, max 2.54
differential pair differentialPair (default): width min 0.127, default 0.254, max 2.54; gap min 0.152, default 0.152
via viaSize (default): diameter min 0.5, default 0.61, max 10; hole min 0.3, default 0.305, max 6

## Placement (name value [footprint] x y rotation side)
C1  10uF  [CASE-A_3216]  7.13 10.54 270 bottom
C2  100nF  [CASE-A_3216]  9.7 11.12 270 bottom
C5  100nF  [CASE-A_3216]  5.88 19.07 180 bottom
C6  10uF  [CASE-A_3216]  5.9 16.57 180 bottom
ESP32-S  2.4GHz  [wirelm-smd_esp32-s]  9.45 15.37 0 top
J1  HDR-M-2.54_1x10  [hdr-th_10p-p2.54-v-f-r2-c5-s2.54-4]  9.41 2.79 0 top
PRG  TS-1064S-A1B2-D4  [KEY-SMD_L3.0-W2.5-LS4.0]  17.45 3.56 90 top
R2  10kΩ  [r0603]  4.66 21.84 180 bottom
R3  10kΩ  [R0603]  4.72 13.76 180 bottom
R4  10kΩ  [r0603]  16.61 17.73 270 bottom
RST  TS-1064S-A1B2-D4  [KEY-SMD_L3.0-W2.5-LS4.0]  1.45 3.56 90 top
U2  AMS1117-3.3S  [SOT-223-4_L6.5-W3.5-P2.30-LS7.0-BL]  11.99 17.88 180 bottom

## Footprints (pads in the part's own frame, mm; a bottom-side part is the same pattern mirrored in y, then rotated)
CASE-A_3216
  rect 1.5x1.359 smd: 1(-1.2,0) 2(1.2,0)
hdr-th_10p-p2.54-v-f-r2-c5-s2.54-4
  rect 1.7x1.7 hole 1.05: 1(-5.08,1.27)
  round 1.7 hole 1.05: 2(-5.08,-1.27) 3(-2.54,1.27) 4(-2.54,-1.27) 5(0,1.27) 6(0,-1.27) 7(2.54,1.27) 8(2.54,-1.27) 9(5.08,1.27) 10(5.08,-1.27)
KEY-SMD_L3.0-W2.5-LS4.0
  rect 1x1.8 smd: 1(-1.85,0) 2(1.85,0)
r0603
  rect 0.806x0.864 smd: 1(-0.753,0) 2(0.753,0)
R0603
  rect 0.806x0.864 smd: 1(-0.753,0) 2(0.753,0)
SOT-223-4_L6.5-W3.5-P2.30-LS7.0-BL
  rect 0.98x2.47 smd: 1(-2.3,-2.835) 2(0,-2.835) 3(2.3,-2.835)
  rect 3.6x2.47 smd: 4(0,2.835)
wirelm-smd_esp32-s
  rect 1.498x1 smd: 1(-8.365,9.005) 2(-8.365,7.735) 3(-8.365,6.465) 4(-8.365,5.195) 5(-8.365,3.925) 6(-8.365,2.655) 7(-8.365,1.385) 8(-8.365,0.115) 9(-8.365,-1.155) 10(-8.365,-2.425) 11(-8.365,-3.695) 12(-8.365,-4.965) 13(-8.365,-6.235) 14(-8.365,-7.505) 25(8.365,-7.505) 26(8.365,-6.235) 27(8.365,-4.965) 28(8.365,-3.695) 29(8.365,-2.425) 30(8.365,-1.155) 31(8.365,0.115) 32(8.365,1.385) 33(8.365,2.655) 34(8.365,3.925) 35(8.365,5.195) 36(8.365,6.465) 37(8.365,7.735) 38(8.365,9.005)
  rect 3.6x3.6 smd: 39(-1.105,1.815)

## Nets
+3.3V: C5.1 C6.1 ESP32-S.2 R2.1 R4.1 U2.2
+5V: C1.1 C2.1 J1.1 U2.3
GND: C1.2 C2.2 C5.2 C6.2 ESP32-S.1 J1.2 PRG.1 R3.1 RST.1 U2.1
EN: ESP32-S.3 R2.2 RST.2
GPIO0: ESP32-S.25 PRG.2 R4.2
GPIO12: ESP32-S.14 R3.2
GPIO16: ESP32-S.27 J1.3
GPIO17: ESP32-S.28 J1.4
GPIO23: ESP32-S.37 J1.6
GPIO32: ESP32-S.8 J1.5
RXD: ESP32-S.34 J1.7
SCL: ESP32-S.36 J1.10
SDA: ESP32-S.33 J1.9
TXD: ESP32-S.35 J1.8

Pads without a net: ESP32-S 4 5 6 7 9 10 11 12 13 26 29 30 31 32 38 39; U2 4

## Via types
v1: diameter 0.8, hole 0.4, Top Layer to Bottom Layer, 11 vias

## Routing (per net, layer and track width the routed paths; a pad name or vN(x,y) marks a point on that pad's centre or on a via; arc(x,y) is an arc through that point)
+3.3V: length 33.9
  Top Layer w0.8: 2.49,23.09 2.48,23.1 ESP32-S.2
  Bottom Layer w0.8: 7.11,16.7 7.11,16.51 ; 7.11,16.7 8.62,18.21 10.6,18.21 11.99,16.81 U2.2 ; 7.11,16.7 7.06,16.74 7.06,20.31 ; 7.11,16.7 7.04,16.63 ; 2.52,23.1 2.53,23.11 4.25,23.11 7.06,20.31 ; R4.1 15.02,20.07 15.02,22.56 14.38,23.2 8.66,23.2 7.13,21.67 7.06,21.67 7.06,20.31 ; 7.06,20.31 7.08,20.29
  vias: v1(2.49,23.1)
+5V: length 14.5
  Bottom Layer w0.8: J1.1 4.33,9.67 6.91,12.24 9.21,12.24 9.69,12.72 9.69,15.04 U2.3
GND: length 6.5
  Top Layer w0.8: RST.1 1.63,1.52 J1.2 ; PRG.1 16.53,1.71 15.95,2.29 v1(15.95,2.64) ; ESP32-S.1 v1(2.49,24.37)
EN: length 20.3
  Top Layer w0.8: 2.49,21.84 2.48,21.83 ESP32-S.3 ; v1(1.47,6.5) 1.45,6.48 RST.2
  Bottom Layer w0.8: v1(1.47,6.5) 1.47,6.5 0.7,7.27 0.7,20.05 2.49,21.85 3.82,21.85
  vias: v1(2.49,21.84)
GPIO0: length 12.8
  Top Layer w0.8: 17.61,7.89 17.78,7.89 ESP32-S.25 ; 17.61,7.89 v1(16.61,7.89) ; 17.61,7.89 17.72,7.78 17.72,5.67 PRG.2
  Bottom Layer w0.8: v1(16.61,7.89) 16.61,7.9 16.61,16.85
GPIO12: length 8
  Top Layer w0.8: ESP32-S.14 2.48,7.86 2.48,7.86 2.51,7.86
  Bottom Layer w0.8: 2.51,7.86 2.51,12.45 3.93,13.87
  vias: v1(2.49,7.86)
GPIO16: length 16.3
  Top Layer w0.4: 17.82,10.45 17.8,10.43 16.58,10.43 14.97,8.82 v1(14.95,8.82)
  Bottom Layer w0.4: v1(14.95,8.82) 13.42,7.29 6.47,7.29 6.3,7.11 6.3,4.67 6.93,4.04 7.02,4.04
GPIO17: length 20.6
  Top Layer w0.4: 17.89,11.75 17.8,11.66 15.52,11.66 14.48,10.62 v1(14.43,10.62)
  Bottom Layer w0.4: 6.89,1.41 5.62,2.68 5.62,7.39 6.15,7.92 11.73,7.92 v1(14.43,10.62)
GPIO23: length 28
  Top Layer w0.4: ESP32-S.37 17.8,23.11 14.63,23.11 11.07,19.56 11.07,13.61 8.18,10.72 8.18,2.68 9.4,1.46
GPIO32: length 16
  Top Layer w0.4: 7.15,6.32 7.16,6.33 7.16,11.33 3.01,15.48 ESP32-S.8
  Bottom Layer w0.4: 9.41,4.14 9.35,4.14 v1(7.15,6.33)
RXD: length 19.3
  Top Layer w0.4: ESP32-S.34 17.78,19.25 14.97,19.25 12.85,17.14 12.85,12.19 11.94,11.28 11.94,4.08 J1.7
SCL: length 25.8
  Top Layer w0.8: v1(16.65,21.83) ESP32-S.36
  Bottom Layer w0.4: v1(16.65,21.83) 18.43,20.05 18.43,2.93 16.46,0.96 15.05,0.96 J1.10
SDA: length 17.4
  Top Layer w0.4: J1.9 13.31,5.25 13.31,11.07 13.77,11.53 13.77,15.87 15.93,18.03 17.8,18.03 ESP32-S.33
TXD: length 24.7
  Top Layer w0.4: ESP32-S.35 17.79,20.58 14.18,20.58 11.94,18.34 11.94,12.83 10.67,11.56 10.67,2.81 J1.8

## Copper pours and planes (outline as drawn; the poured copper is in the pictures)
GND on Bottom Layer: 0.1,25.15 18.83,25.15 18.83,0 0.1,0

## Text on the board
Bottom Silkscreen Layer: +5V | GND | IO17 | IO16 | IO23 | IO32 | TXD | RXD | SCL | SDA | RST | PRG
Top Silkscreen Layer: +5V | GND | IO17 | IO16 | IO23 | IO32 | TXD | RXD | SCL | SDA

# Board PCB3
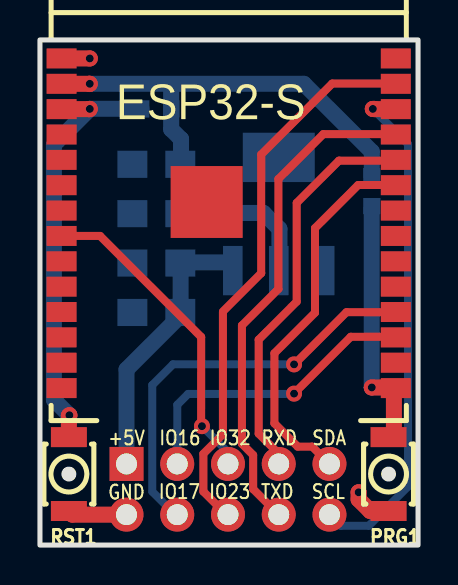
[diagram p7: board, top side]
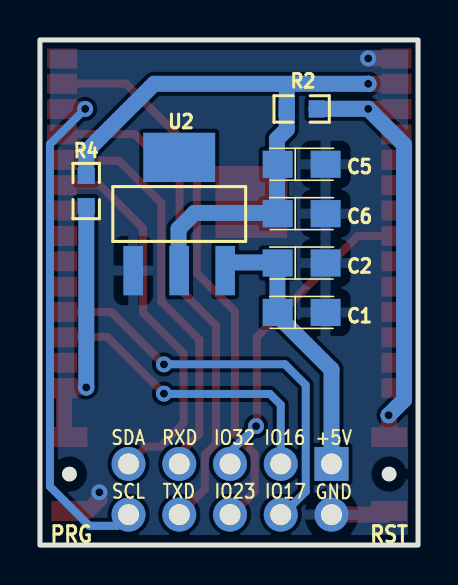
[diagram p8: board, bottom side, seen from below]

Outline 18.93 x 25.3 mm; copper layers: Top Layer, Bottom Layer. Coordinates in mm from the lower left corner of the outline.
Outline path: rectangle 0,25.3 18.93,0
Stack: Top Layer 0.035mm / Dielectric1 1.51mm FR4 er 4.5 / Bottom Layer 0.035mm

## Design rules (mm)
spacing safeClearance (default): track to track 0.152, other pairs 0.152 to 0.3
track width trackWidth (default): min 0.127, default 0.254, max 2.54
differential pair differentialPair (default): width min 0.127, default 0.254, max 2.54; gap min 0.152, default 0.152
via viaSize (default): diameter min 0.5, default 0.61, max 10; hole min 0.3, default 0.305, max 6

## Placement (name value [footprint] x y rotation side)
C1  10uF  [CASE-A_3216]  5.83 11.65 180 bottom
C2  100nF  [CASE-A_3216]  5.83 14.12 180 bottom
C5  100nF  [CASE-A_3216]  5.83 19.07 180 bottom
C6  10uF  [CASE-A_3216]  5.83 16.6 180 bottom
ESP32-S  2.4GHz  [wirelm-smd_esp32-s]  9.45 15.37 0 top
J1  HDR-M-2.54_1x10  [hdr-th_10p-p2.54-v-f-r2-c5-s2.54-4]  9.41 2.79 0 top
PRG1  TS-1064S-A1B2-D4  [KEY-SMD_L3.0-W2.5-LS4.0]  17.45 3.56 90 top
R2  10kΩ  [r0603]  5.83 21.84 180 bottom
R4  10kΩ  [r0603]  16.61 17.73 270 bottom
RST1  TS-1064S-A1B2-D4  [KEY-SMD_L3.0-W2.5-LS4.0]  1.45 3.56 90 top
U2  AMS1117-3.3S  [SOT-223-4_L6.5-W3.5-P2.30-LS7.0-BL]  11.96 16.58 180 bottom

## Footprints (pads in the part's own frame, mm; a bottom-side part is the same pattern mirrored in y, then rotated)
CASE-A_3216
  rect 1.5x1.359 smd: 1(-1.2,0) 2(1.2,0)
hdr-th_10p-p2.54-v-f-r2-c5-s2.54-4
  rect 1.7x1.7 hole 1.05: 1(-5.08,1.27)
  round 1.7 hole 1.05: 2(-5.08,-1.27) 3(-2.54,1.27) 4(-2.54,-1.27) 5(0,1.27) 6(0,-1.27) 7(2.54,1.27) 8(2.54,-1.27) 9(5.08,1.27) 10(5.08,-1.27)
KEY-SMD_L3.0-W2.5-LS4.0
  rect 1x1.8 smd: 1(-1.85,0) 2(1.85,0)
r0603
  rect 0.806x0.864 smd: 1(-0.753,0) 2(0.753,0)
SOT-223-4_L6.5-W3.5-P2.30-LS7.0-BL
  rect 0.98x2.47 smd: 1(-2.3,-2.835) 2(0,-2.835) 3(2.3,-2.835)
  rect 3.6x2.47 smd: 4(0,2.835)
wirelm-smd_esp32-s
  rect 1.498x1 smd: 1(-8.365,9.005) 2(-8.365,7.735) 3(-8.365,6.465) 4(-8.365,5.195) 5(-8.365,3.925) 6(-8.365,2.655) 7(-8.365,1.385) 8(-8.365,0.115) 9(-8.365,-1.155) 10(-8.365,-2.425) 11(-8.365,-3.695) 12(-8.365,-4.965) 13(-8.365,-6.235) 14(-8.365,-7.505) 25(8.365,-7.505) 26(8.365,-6.235) 27(8.365,-4.965) 28(8.365,-3.695) 29(8.365,-2.425) 30(8.365,-1.155) 31(8.365,0.115) 32(8.365,1.385) 33(8.365,2.655) 34(8.365,3.925) 35(8.365,5.195) 36(8.365,6.465) 37(8.365,7.735) 38(8.365,9.005)
  rect 3.6x3.6 smd: 39(-1.105,1.815)

## Nets
As in the schematic.

Pads without a net: ESP32-S 4 5 6 7 9 10 11 12 13 26 29 30 31 32 38 39; U2 4

## Via types
v1: diameter 0.8, hole 0.4, Top Layer to Bottom Layer, 10 vias

## Routing (per net, layer and track width the routed paths; a pad name or vN(x,y) marks a point on that pad's centre or on a via; arc(x,y) is an arc through that point)
+3.3V: length 31.1
  Top Layer w0.8: 2.49,23.09 2.48,23.1 ESP32-S.2
  Bottom Layer w0.8: 7.11,16.7 7.17,16.63 11.19,16.63 11.99,15.83 11.99,15.05 ; 7.11,16.7 7.04,16.63 ; 7.11,16.7 7.11,16.51 ; 7.11,16.7 7.06,16.74 7.06,20.33 ; R4.1 16.61,19.7 13.21,23.1 2.49,23.1 2.47,23.09 ; 7.06,20.33 6.57,20.82 6.57,23.08 6.56,23.09 ; 7.06,20.33 7.04,20.33
  vias: v1(2.49,23.1)
+5V: length 13.7
  Bottom Layer w0.8: 9.67,14.16 7.2,14.16 7.04,14 7.04,11.5 4.33,8.79 J1.1
GND: length 6.5
  Top Layer w0.8: PRG1.1 16.53,1.71 15.95,2.29 v1(15.95,2.64) ; J1.2 1.63,1.52 RST1.1 ; ESP32-S.1 v1(2.49,24.37)
EN: length 21.5
  Top Layer w0.8: 2.49,21.84 2.48,21.83 ESP32-S.3 ; RST1.2 1.45,6.48 v1(1.47,6.5)
  Bottom Layer w0.8: v1(1.47,6.5) 1.47,6.5 0.7,7.27 0.7,20.05 2.49,21.85 5.06,21.85 5.09,21.83
  vias: v1(2.49,21.84)
GPIO0: length 12.8
  Top Layer w0.8: 17.61,7.89 17.78,7.89 ESP32-S.25 ; 17.61,7.89 17.72,7.78 17.72,5.67 PRG1.2 ; 17.61,7.89 v1(16.61,7.89)
  Bottom Layer w0.8: 16.61,16.85 16.61,7.9 v1(16.61,7.89)
GPIO16: length 15.3
  Top Layer w0.4: 17.82,10.45 17.8,10.43 15.56,10.43 12.73,7.6 12.73,7.58
  Bottom Layer w0.4: 12.73,7.58 12.71,7.57 7.42,7.57 6.87,7.03 6.87,4.08 6.86,4.06
  vias: v1(12.72,7.58)
GPIO17: length 20.9
  Top Layer w0.4: 17.89,11.75 17.8,11.66 15.34,11.66 12.73,9.05 v1(12.72,9.05)
  Bottom Layer w0.4: 6.89,1.41 5.62,2.68 5.62,8.02 6.66,9.05 12.72,9.05 v1(12.72,9.05)
GPIO23: length 28
  Top Layer w0.4: 9.16,11.66 9.16,5.55 8.18,4.57 8.18,2.68 9.4,1.46 ; 9.16,11.7 11.07,13.61 11.07,19.56 14.63,23.11 17.8,23.11 ESP32-S.37
GPIO32: length 15.9
  Top Layer w0.4: ESP32-S.8 3.01,15.48 8.07,10.42 8.07,5.91
  Bottom Layer w0.4: v1(8.11,5.95) 9.41,4.65 9.41,4.14
RXD: length 20.1
  Top Layer w0.4: ESP32-S.34 17.78,19.25 14.97,19.25 12.85,17.14 12.85,12.19 10.95,10.29 10.95,5.58 11.95,4.58 J1.7
SCL: length 25.8
  Top Layer w0.8: v1(16.66,21.84) 16.74,21.84 16.75,21.83 ESP32-S.36
  Bottom Layer w0.4: v1(16.66,21.84) 18.43,20.08 18.43,2.93 16.46,0.96 15.05,0.96 J1.10
SDA: length 19.2
  Top Layer w0.4: ESP32-S.33 17.8,18.03 15.93,18.03 13.77,15.87 13.77,11.64 11.74,9.61 11.74,6.09 12.9,4.93 13.63,4.93 J1.9
TXD: length 25.1
  Top Layer w0.4: J1.8 10.67,2.8 10.67,4.51 10.11,5.07 10.11,11 11.94,12.83 11.94,18.34 14.18,20.58 17.79,20.58 ESP32-S.35

## Copper pours and planes (outline as drawn; the poured copper is in the pictures)
GND on Bottom Layer: 0.1,25.15 18.83,25.15 18.83,0 0.1,0

## Text on the board
Bottom Silkscreen Layer: +5V | GND | IO17 | IO16 | IO23 | IO32 | TXD | RXD | SCL | SDA | RST | PRG
Top Silkscreen Layer: +5V | GND | IO17 | IO16 | IO23 | IO32 | TXD | RXD | SCL | SDA
